# Altium schematic sheet Top.SchDoc
size Letter; SheetNumber: 1; SheetTotal: 6
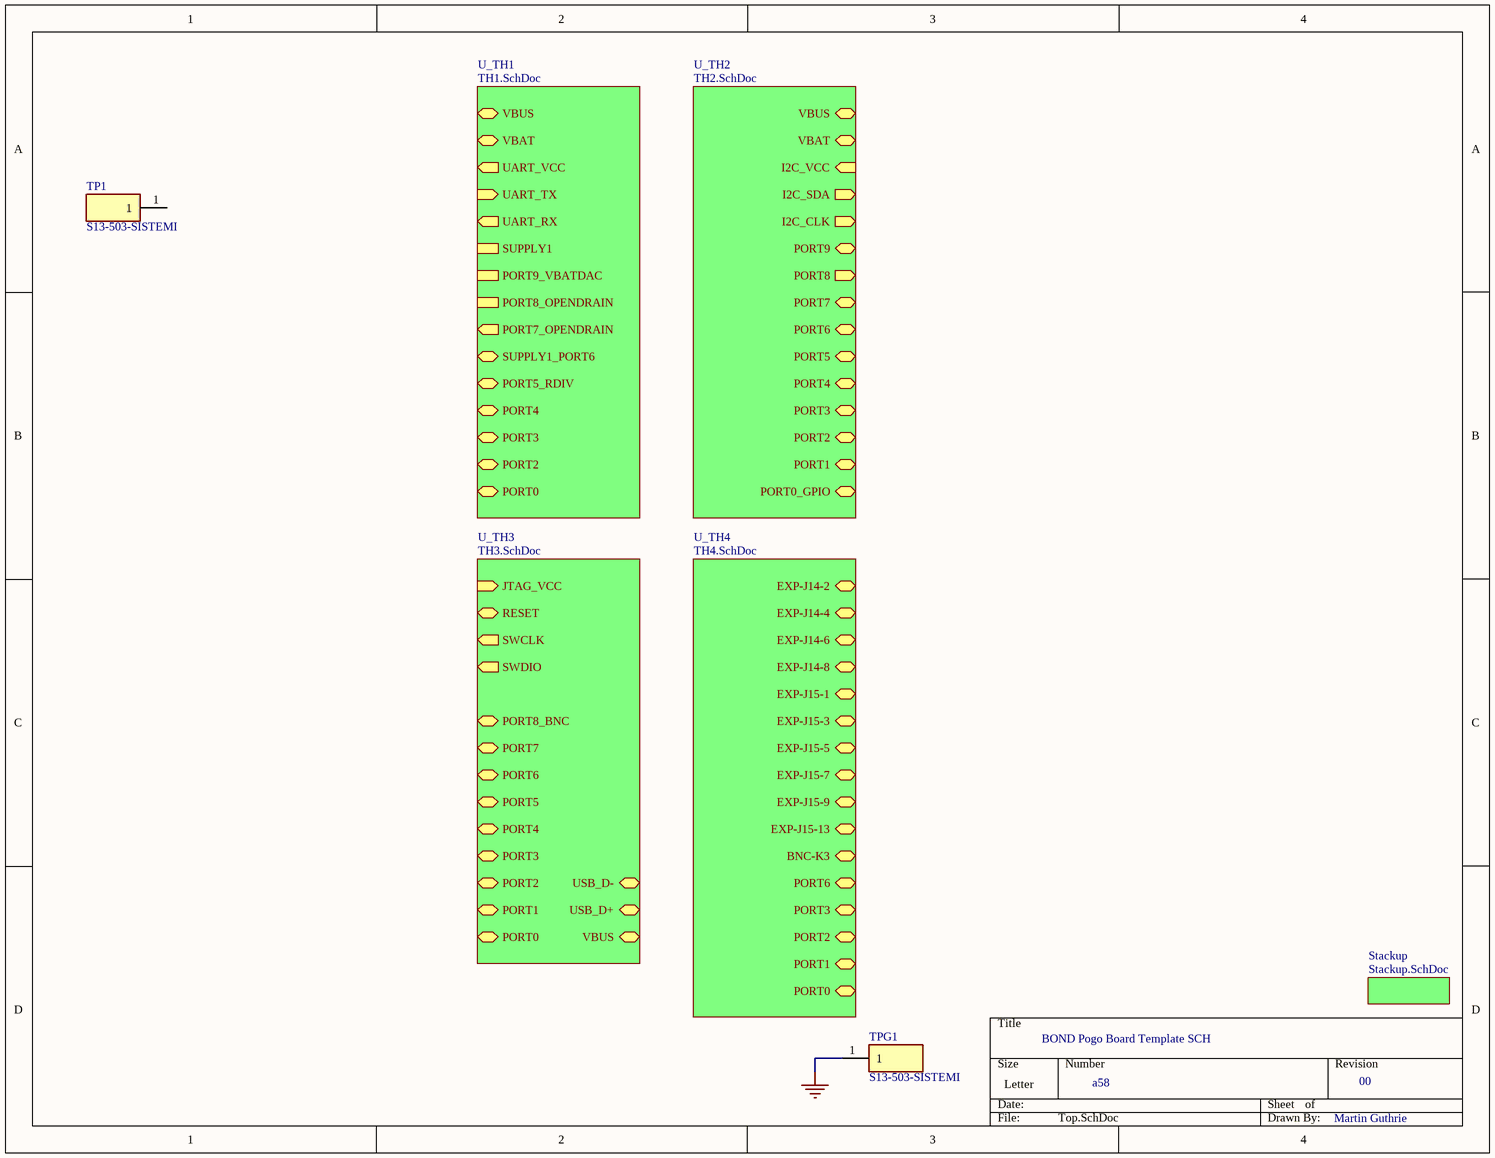
[diagram p0: Top.SchDoc]

## Parts
TP1  S13-503-SISTEMI  [CMP-001-0000-3]
TPG1  S13-503-SISTEMI  [CMP-001-0000-3]

## Sub-sheets
Stackup = Stackup.SchDoc: no entries
U_TH1 = TH1.SchDoc: VBUS (bidir), VBAT (bidir), UART_VCC (out), UART_TX (in), UART_RX (out), SUPPLY1_PORT6 (bidir), SUPPLY1, PORT9_VBATDAC, PORT8_OPENDRAIN, PORT7_OPENDRAIN (out), PORT5_RDIV (bidir), PORT4 (bidir), PORT3 (bidir), PORT2 (bidir), PORT0 (bidir)
U_TH2 = TH2.SchDoc: I2C_VCC (in), I2C_SDA (out), I2C_CLK (out), PORT6 (bidir), PORT0_GPIO (bidir), PORT1 (bidir), VBUS (bidir), PORT8 (out), PORT7 (bidir), PORT9 (bidir), PORT5 (bidir), PORT4 (bidir), PORT3 (bidir), PORT2 (bidir), VBAT (bidir)
U_TH3 = TH3.SchDoc: JTAG_VCC (in), SWDIO (out), SWCLK (out), RESET (bidir), PORT0 (bidir), PORT5 (bidir), USB_D- (bidir), PORT7 (bidir), PORT1 (bidir), PORT2 (bidir), PORT3 (bidir), PORT4 (bidir), VBUS (bidir), USB_D+ (bidir), PORT6 (bidir), PORT8_BNC (bidir)
U_TH4 = TH4.SchDoc: EXP-J14-2 (bidir), EXP-J14-4 (bidir), EXP-J14-6 (bidir), EXP-J14-8 (bidir), PORT0 (bidir), PORT1 (bidir), BNC-K3 (bidir), EXP-J15-1 (bidir), EXP-J15-3 (bidir), EXP-J15-5 (bidir), EXP-J15-7 (bidir), EXP-J15-9 (bidir), PORT3 (bidir), PORT2 (bidir), EXP-J15-13 (bidir), PORT6 (bidir)

## Nets
GND: TPG1.1

Not connected (* = marked no-connect by the designer): TP1 1

## Notes on the sheet
- BOND Pogo Board Template SCH
- a58
- 00
- Martin Guthrie

## Library data of the parts
TP1 = CMP-001-0000-3: Sistemi Version of Hirose S13-503
TPG1 = CMP-001-0000-3_GND: Sistemi Version of Hirose S13-503 (GND)